# Altium project E22_TTL_RS232(v0.1)-20200417.PrjPcb
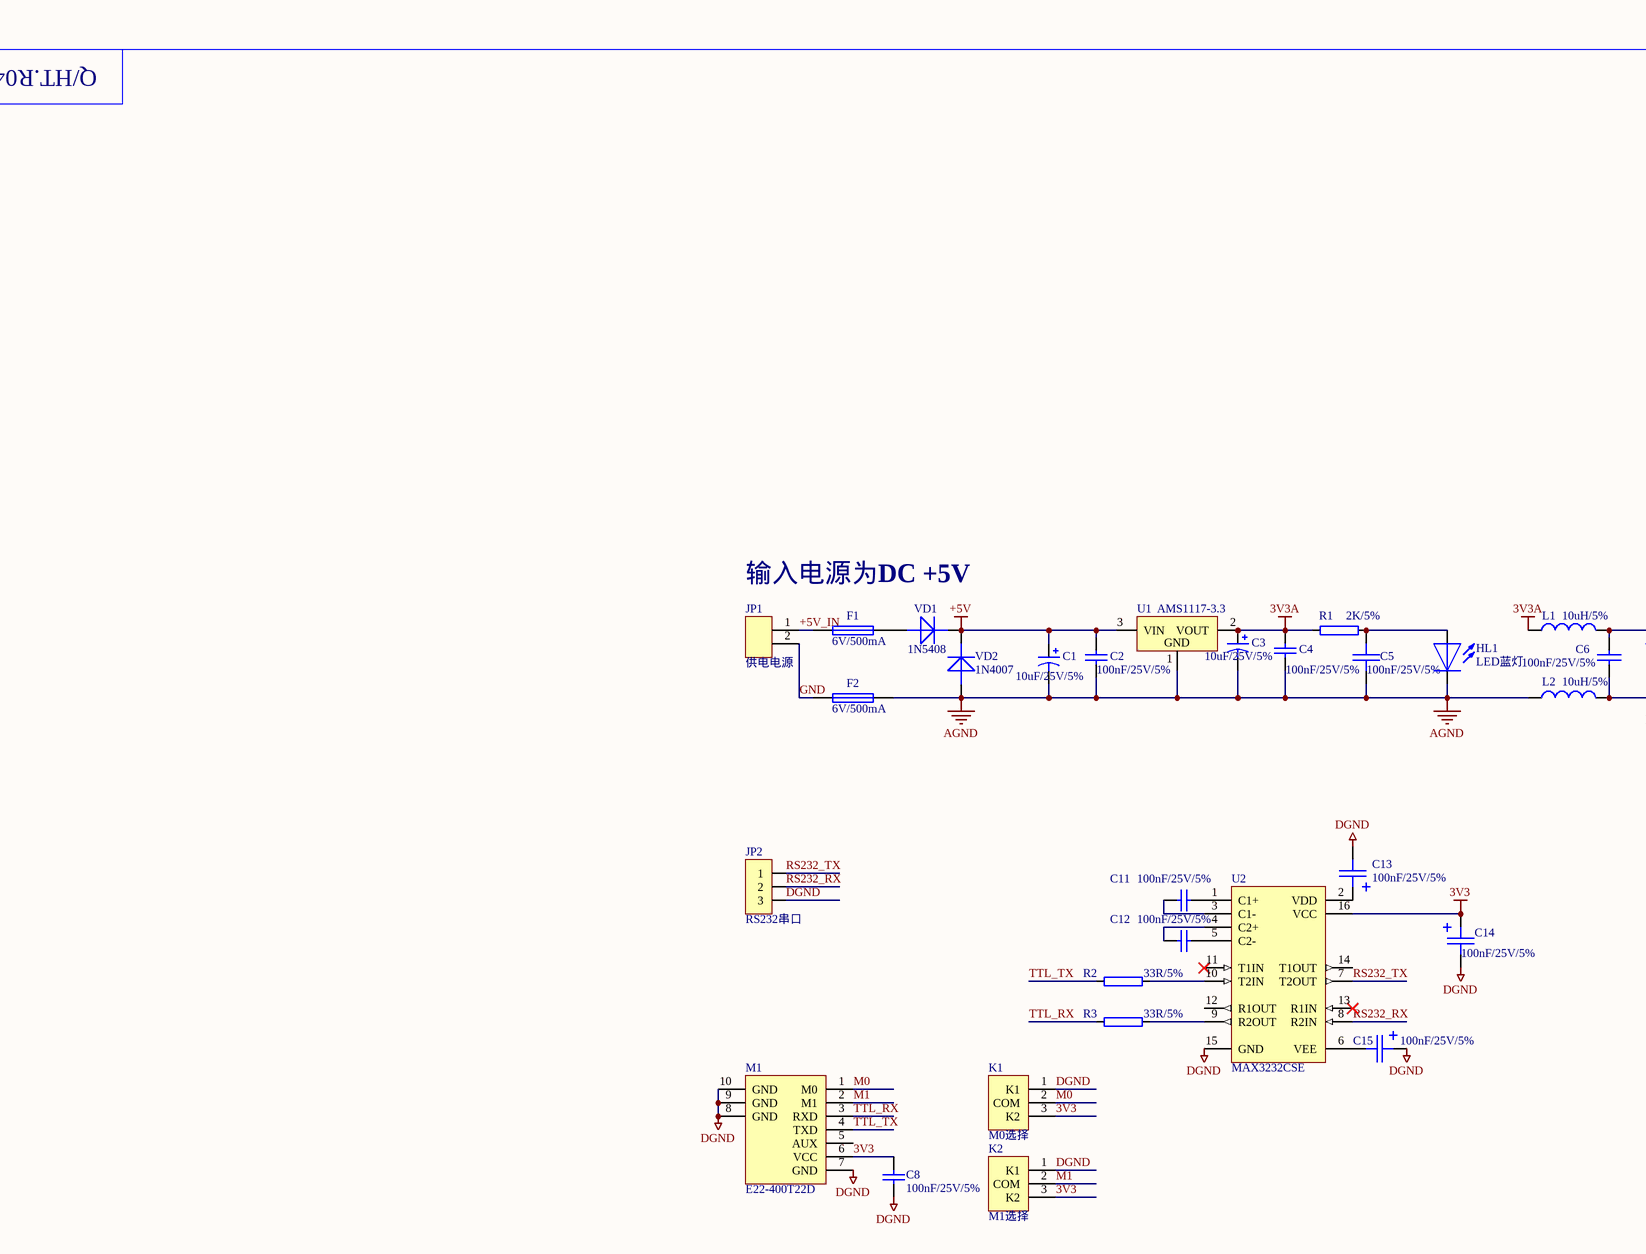
[diagram p0: E22_TTL_RS232(v0.1)-20200417.SchDoc, top left]
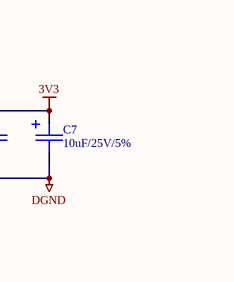
[diagram p1: E22_TTL_RS232(v0.1)-20200417.SchDoc, top right]
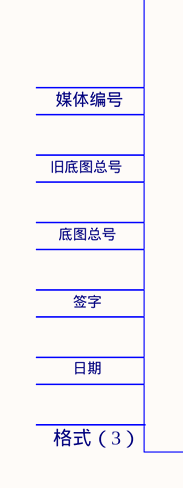
[diagram p2: E22_TTL_RS232(v0.1)-20200417.SchDoc, bottom left]
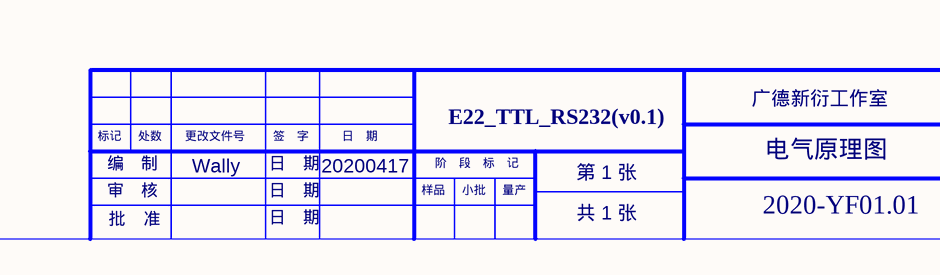
[diagram p3: E22_TTL_RS232(v0.1)-20200417.SchDoc, bottom right]
1 sheet, 30 parts. Net scope: global (net labels, ports and power ports of the same name join across sheets).
Board file: E22_TTL_RS232(v0.1)-20200417.PcbDoc

## Sheet E22_TTL_RS232(v0.1)-20200417.SchDoc
size A2; SheetNumber: 0; SheetTotal: 0; PageSetup: Record=PageOptions|CenterHorizontal=True|CenterVertical=True|PrintScale=0.71|XCorrection=1.00|YCorrection=1.00|PrintKind=2|BorderSize=5000000|LeftOffset=0|BottomOffset=0|Orientation=2|PaperLength=1000|PaperWidth=1000|Scale=100|PaperSource=7|PrintQuality=-4|MediaType=1|DitherType=10|PaperKind=A3|PrintScaleMode=1

### Parts
C1  10uF/25V/5%  [C1206-1]
C2  100nF/25V/5%  [C0603]
C3  10uF/25V/5%  [C1206-1]
C4  100nF/25V/5%  [C0603]
C5  100nF/25V/5%  [C0603]
C6  100nF/25V/5%  [C0603]
C7  10uF/25V/5%  [C1206-1]
C8  100nF/25V/5%  [C0603]
C11  100nF/25V/5%  [C0603]
C12  100nF/25V/5%  [C0603]
C13  100nF/25V/5%  [C1206-1]
C14  100nF/25V/5%  [C1206-1]
C15  100nF/25V/5%  [C1206-1]
F1  6V/500mA  [F1812]
F2  6V/500mA  [F1812]
HL1  LED蓝灯  [LED0603]
JP1  供电电源  [XH2.54-LI-2P]
JP2  RS232串口  [PH2.0-LI-3P]
K1  M0选择  [SK-12D07]
K2  M1选择  [SK-12D07]
L1  10uH/5%  [L0603]
L2  10uH/5%  [L0603]
M1  E22-400T22D  [E22-400T22D]
R1  2K/5%  [R0603]
R2  33R/5%  [R0603]
R3  33R/5%  [R0603]
U1  AMS1117-3.3  [SOT230P700X180-4N]
U2  MAX3232CSE  [NSO16_M]
VD1  1N5408  [SMA_DO-214AC]
VD2  1N4007  [SMA_DO-214AC]

### Nets
3V3: C6.2 C7.1 C8.2 C14.1 K1.3(K2) K2.3(K2) L1.2 M1.6(VCC) U2.16(VCC)
3V3A: C3.1 C4.2 L1.1 R1.1 U1.2(VOUT)
+5V: C1.1 C2.2 U1.3(VIN) VD1.K VD2.K
AGND: C1.2 C2.1 C3.2 C4.1 C5.2 F2.2 HL1.K L2.1 U1.1(GND) VD2.A
DGND: C6.1 C7.2 C8.1 C13.2 C14.2 C15.1 JP2.3 K1.1(K1) K2.1(K1) L2.2 M1.7(GND) M1.8(GND) M1.9(GND) M1.10(GND) U2.15(GND)
+5V_IN: F1.1 JP1.1
GND: F2.1 JP1.2
M0: K1.2(COM) M1.1(M0)
M1: K2.2(COM) M1.2(M1)
RS232_RX: JP2.2 U2.8(R2IN)
RS232_TX: JP2.1 U2.7(T2OUT)
TTL_RX: M1.3(RXD) R3.2
TTL_TX: M1.4(TXD) R2.2
NetC5_1: C5.1 HL1.A R1.2
NetC11_1: C11.1 U2.3(C1-)
NetC11_2: C11.2 U2.1(C1+)
NetC12_1: C12.1 U2.4(C2+)
NetC12_2: C12.2 U2.5(C2-)
NetC13_1: C13.1 U2.2(VDD)
NetC15_2: C15.2 U2.6(VEE)
NetF1_2: F1.2 VD1.A
NetR2_1: R2.1 U2.10(T2IN)
NetR3_1: R3.1 U2.9(R2OUT)

Not connected (* = marked no-connect by the designer): M1 5(AUX); U2 11(T1IN)* 12(R1OUT) 13(R1IN)* 14(T1OUT)

### Notes on the sheet
- Q/HT.R04.030-2016
- 输入电源为DC +5V
- 媒体编号
- 旧底图总号
- 底图总号
- 签字
- E22_TTL_RS232(v0.1)
- 广德新衍工作室
- 日期
- 标记
- 编　制
- 审　核
- 处数
- 更改文件号
- Wally
- 日　期
- 签　字
- 20200417
- 样品
- 阶　段　标　记
- 小批
- 量产
- 第 1 张
- 电气原理图
- 格式（3）
- 批    准
- 共 1 张
- 2020-YF01.01

### Library data of the parts
C1 C3 = Cap Pol1: 钽电容; Published: 8-Jun-2000; LatestRevisionDate: 17-Jul-2002; LatestRevisionNote: Re-released for DXP Platform.; PackageReference: RB7.6-15; Publisher: Altium Limited; Value: 10uF/25V/5%
C2 C4 = Cap: 电容; Published: 8-Jun-2000; LatestRevisionDate: 17-Jul-2002; LatestRevisionNote: Re-released for DXP Platform.; PackageReference: RAD-0.3; Publisher: Altium Limited; Value: 100nF/25V/5%
C5 C6 = CAP: 电容
C7 C13-C15 = ELECTRO1: 钽电容
C8 C11 C12 = CAP-SMD: 电容
F1 F2 = 保险丝: 自恢复保险丝
HL1 = 发光二极管
JP1 = XH2.54-2P/PH2.0-2P: XH2.54-2P/PH2.0-2P插座
JP2 = XH2.54-3P/PH2.0-3P: PH2.0-3P直插插座
K1 K2 = SK-12D07: SK-12D07：3脚2档小型拨动开关
L1 L2 = 电感
M1 = E22-400T22D: E22-400T22D LoRa模块
R1-R3 = RES2: 电阻
U1 = U_AMS1117: U_AMS1117稳压芯片
U2 = MAX232CSE: +5V Powered, Multi-Channel RS-232 Driver/Receiver; Published: 16-Jan-2001; LatestRevisionDate: 13-Apr-2006; LatestRevisionNote: IPC-7351 Footprint Added.; PackageReference: NSO16; Publisher: Altium Limited; PackageDescription: 16-Pin Small Outline Integrated Circuit 1.27 mm Pitch; Code_JEDEC: MS-012-AC; Code_IPC: SOIC127P600-16; ComponentLink1Description: Manufacturer Link; ComponentLink1URL: http://www.maxim-ic.com/; ComponentLink2Description: Datasheet; ComponentLink2URL: http://pdfserv.maxim-ic.com/en/ds/MAX220-MAX249.pdf
VD1 VD2 = 开关二极管